# EAGLE design AmbaSat-1v1-01-NO-solar (EAGLE 7.6.0)
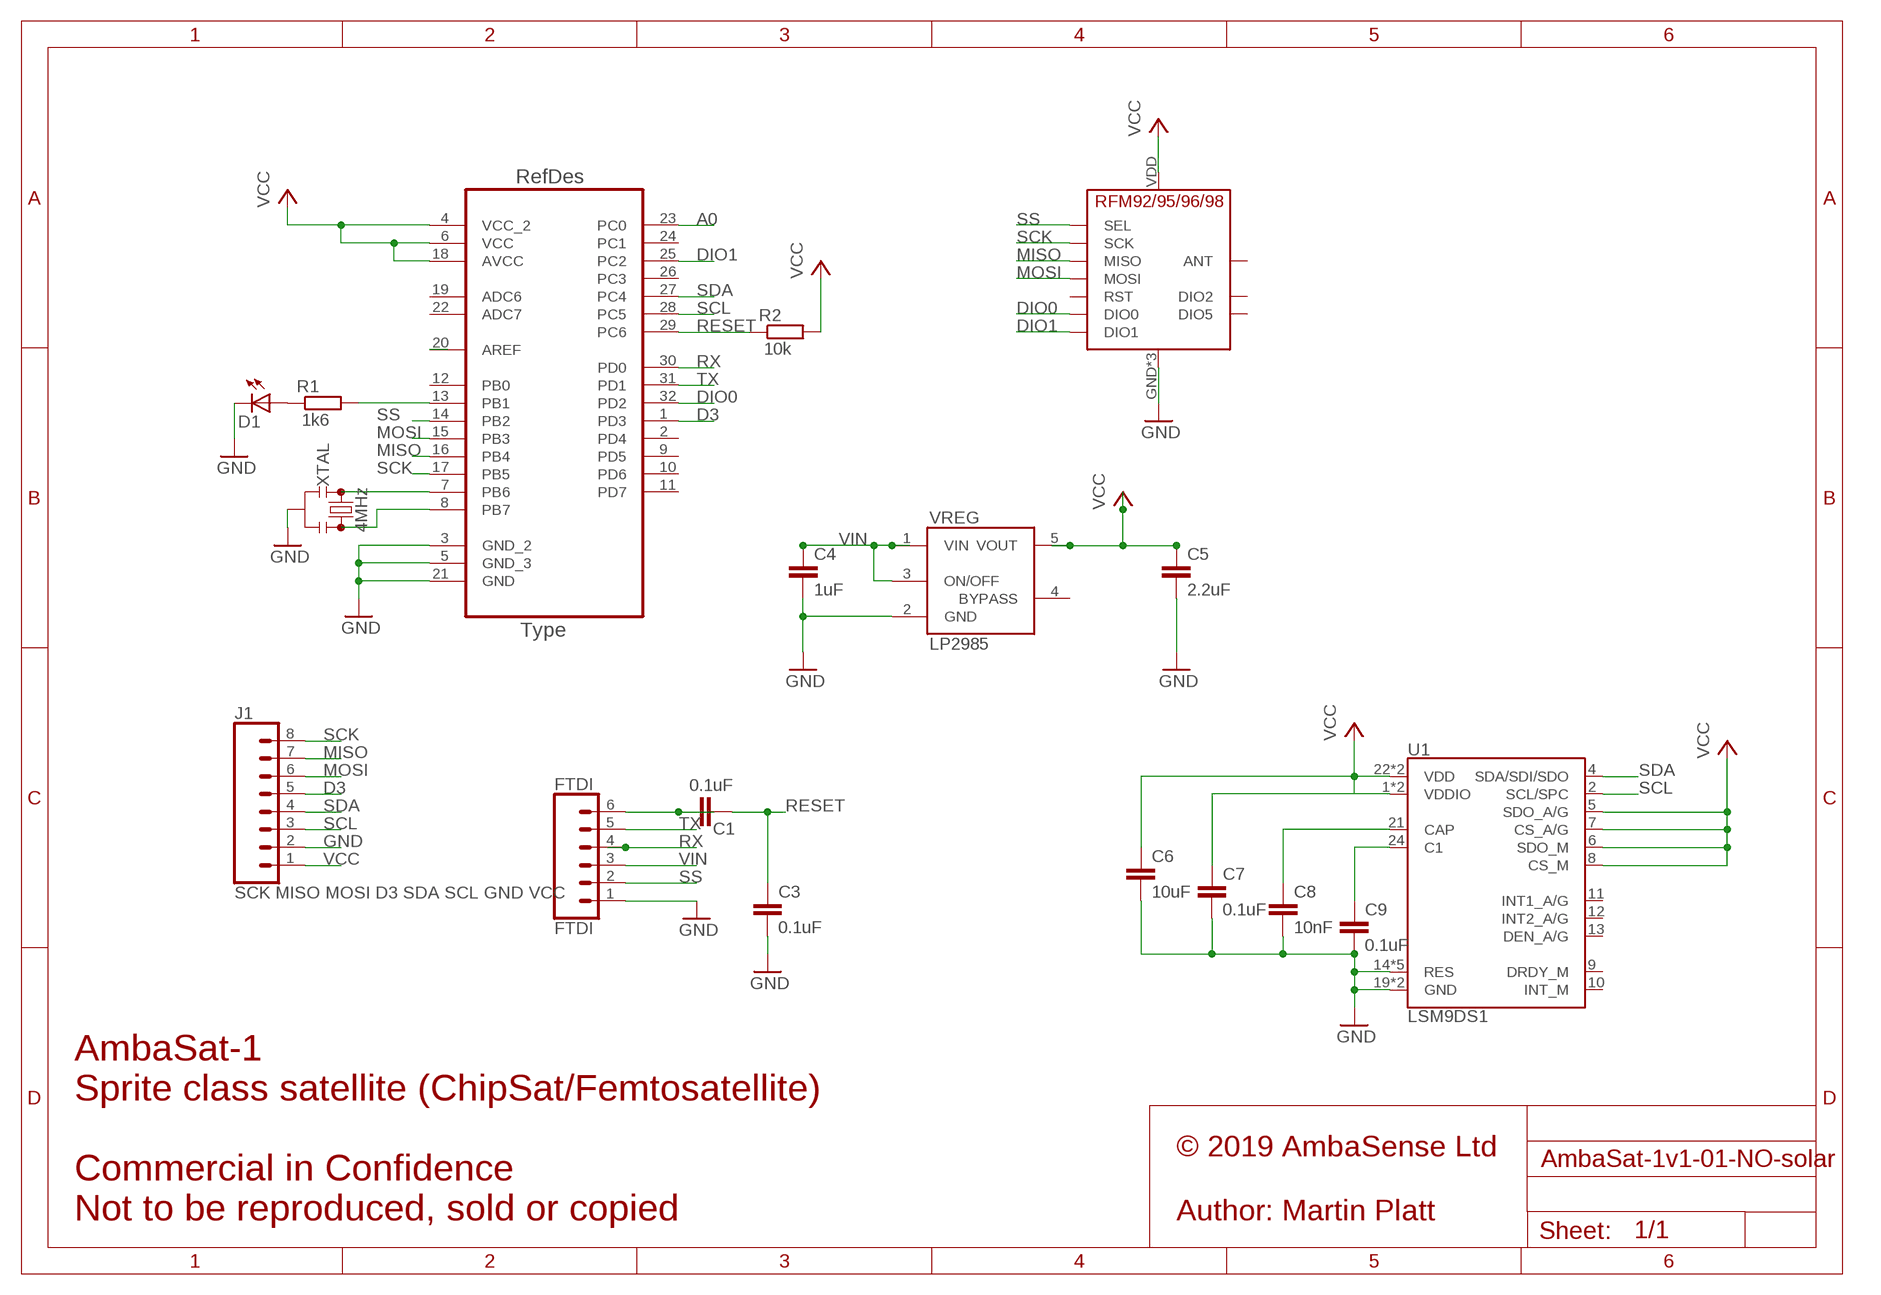
[diagram p0: schematic, sheet 1]

## Parts
ATMEGA328P-AU  ATMEGA328P-AU  [QFP80P900X900X120-32N]
C1  0.1uF  C-EUC0805K  [C0805K]
C3  0.1uF  C-EUC0805K  [C0805K]
C4  1uF  C-EUC0805K  [C0805K]
C5  2.2uF  C-EUC0805K  [C0805K]
C6  10uF  C-EUC0805K  [C0805K]
C7  0.1uF  C-EUC0805K  [C0805K]
C8  10nF  C-EUC0805K  [C0805K]
C9  0.1uF  C-EUC0805K  [C0805K]
D1  LEDCHIP-LED0805  [CHIP-LED0805]
FTDI  FTDI  CONN_06LONGPADS  [1X06_LONGPADS]
J1  SCK MISO MOSI D3 SDA SCL GND VCC  CONN_08LONGPADS  [1X08_LONGPADS]
R1  1k6  R-EU_M0805  [M0805]
R2  10k  R-EU_M0805  [M0805]
RFM95  RFM95  [RFM95]
U1  LSM9DS1  [LGA24-8X4]
VREG  LP2985AIM5-3.3  [SOT25]
XTAL  4MHz  RESONATOR-4MHZSMD-4.5X2  [RESONATOR-SMD-4.5X2.0]

## Nets
A0: ATMEGA328P-AU.23(PC0)
AREF: ATMEGA328P-AU.20(AREF)
D3: ATMEGA328P-AU.1(PD3) J1.5
DIO0: ATMEGA328P-AU.32(PD2) RFM95.DIO0
DIO1: ATMEGA328P-AU.25(PC2) RFM95.DIO1
GND: ATMEGA328P-AU.3(GND_2) ATMEGA328P-AU.5(GND_3) ATMEGA328P-AU.21(GND) C3.2 C4.2 C5.2 C6.2 C7.2 C8.2 C9.2 D1.C FTDI.1 J1.2 RFM95.GND RFM95.GND1(GND) RFM95.GND2(GND) U1.14(RES) U1.15(RES) U1.16(RES) U1.17(RES) U1.18(RES) U1.19(GND) U1.20(GND) VREG.2(GND) XTAL.2
MISO: ATMEGA328P-AU.16(PB4) J1.7 RFM95.MISO
MOSI: ATMEGA328P-AU.15(PB3) J1.6 RFM95.MOSI
N$1: ATMEGA328P-AU.7(PB6) XTAL.1
N$2: ATMEGA328P-AU.8(PB7) XTAL.3
N$3: ATMEGA328P-AU.13(PB1) R1.2
N$4: D1.A R1.1
N$6: C1.2 FTDI.6
N$7: C9.1 U1.24(C1)
N$8: C8.1 U1.21(CAP)
RESET: ATMEGA328P-AU.29(PC6) C1.1 C3.1 R2.1
RX: ATMEGA328P-AU.30(PD0) FTDI.4
SCK: ATMEGA328P-AU.17(PB5) J1.8 RFM95.SCK
SCL: ATMEGA328P-AU.28(PC5) J1.3 U1.2(SCL/SPC)
SDA: ATMEGA328P-AU.27(PC4) J1.4 U1.4(SDA/SDI/SDO)
SS: ATMEGA328P-AU.14(PB2) FTDI.2 RFM95.NSS(SEL)
TX: ATMEGA328P-AU.31(PD1) FTDI.5
VCC: ATMEGA328P-AU.4(VCC_2) ATMEGA328P-AU.6(VCC) ATMEGA328P-AU.18(AVCC) C5.1 C6.1 C7.1 J1.1 R2.2 RFM95.VDD(VCC) U1.1(VDDIO) U1.3(VDDIO) U1.5(SDO_A/G) U1.6(SDO_M) U1.7(CS_A/G) U1.8(CS_M) U1.22(VDD) U1.23(VDD) VREG.5(VOUT)
VIN: C4.1 FTDI.3 VREG.1(VIN) VREG.3(ON/OFF)
Unconnected: ATMEGA328P-AU.2(PD4) ATMEGA328P-AU.9(PD5) ATMEGA328P-AU.10(PD6) ATMEGA328P-AU.11(PD7) ATMEGA328P-AU.12(PB0) ATMEGA328P-AU.19(ADC6) ATMEGA328P-AU.22(ADC7) ATMEGA328P-AU.24(PC1) ATMEGA328P-AU.26(PC3) RFM95.ANT RFM95.DIO2 RFM95.DIO5 RFM95.RST U1.9(DRDY_M) U1.10(INT_M) U1.11(INT1_A/G) U1.12(INT2_A/G) U1.13(DEN_A/G) VREG.4(BYPASS)

## Notes on the sheet
- AmbaSat-1  
  Sprite class satellite (ChipSat/Femtosatellite)
  
  Commercial in Confidence
  Not to be reproduced, sold or copied
- © 2019 AmbaSense Ltd
  
  Author: Martin Platt

## Library data of the parts
ATMEGA328P-AU = Atmel-ATMEGA328P-AU:ATMEGA328P-AU; DESCRIPTION: 8-bit Microcontroller with In-System Programmable Flash; MPN: ATMEGA328P-AU; OC_FARNELL: 1715486; OC_NEWARK: 14R4631; PACKAGE: TQFP-32; SUPPLIER: Atmel
C1 C3-C9 = rcl:C-EU: CAPACITOR, European symbol
D1 = led:LED: LED OSRAM: - CHIPLED LG R971, LG N971, LY N971, LG Q971, LY Q971, LO R971, LY R971 LH N974, LH R974 LS Q976, LO Q976, LY Q976 LO Q996 - Hyper CHIPLED LW Q18S LB Q993, LB Q99A, LB R99A - SideLED LS A670, LO A670, LY A670, LG A670, LP A670 LB A673, LV A673, LT A673, LW A673 LH A674 LY A675 LS A676, LA A676, LO A676, LY A676, LW A676 LS A679, LY A679, LG A679 - Hyper Micro SIDELED® LS Y876, LA Y876, LO Y876, LY Y876 LT Y87S - SmartLED LW L88C, LW L88S LB L89C, LB L89S, LG L890 LS L89K, LO L89K, LY L89K LS L896, LA L896, LO L896, LY L896 - TOPLED LS T670, LO T670, LY T670, LG T670, LP T670 LSG T670, LSP T670, LSY T670, LOP T670, LYG T670 LG T671, LOG T671, LSG T671 LB T673, LV T673, LT T673, LW T673 LH T674 LS T676, LA T676, LO T676, LY T676, LB T676, LH T676, LSB T676, LW T676 LB T67C, LV T67C, LT T67C, LS T67K, LO T67K, LY T67K, LW E67C LS E67B, LA E67B, LO E67B, LY E67B, LB E67C, LV E67C, LT E67C LW T67C LS T679, LY T679, LG T679 LS T770, LO T770, LY T770, LG T770, LP T770 LB T773, LV T773, LT T773, LW T773 LH T774 LS E675, LA E675, LY E675, LS T675 LS T776, LA T776, LO T776, LY T776, LB T776 LHGB T686 LT T68C, LB T68C - Hyper Mini TOPLED® LB M676 - Mini TOPLED Santana® LG M470 LS M47K, LO M47K, LY M47K Source: http://www.osram.convergy.de LUXEON: - LUMILED® LXK2-PW12-R00, LXK2-PW12-S00, LXK2-PW14-U00, LXK2-PW14-V00 LXK2-PM12-R00, LXK2-PM12-S00, LXK2-PM14-U00 LXK2-PE12-Q00, LXK2-PE12-R00, LXK2-PE12-S00, LXK2-PE14-T00, LXK2-PE14-U00 LXK2-PB12-K00, LXK2-PB12-L00, LXK2-PB12-M00, LXK2-PB14-N00, LXK2-PB14-P00, LXK2-PB14-Q00 LXK2-PR12-L00, LXK2-PR12-M00, LXK2-PR14-Q00, LXK2-PR14-R00 LXK2-PD12-Q00, LXK2-PD12-R00, LXK2-PD12-S00 LXK2-PH12-R00, LXK2-PH12-S00 LXK2-PL12-P00, LXK2-PL12-Q00, LXK2-PL12-R00 Source: www.luxeon.com KINGBRIGHT: KA-3528ASYC Source: www.kingbright.com
FTDI = SparkFun-Connectors:CONN_06: Multi connection point. Often used as Generic Header-pin footprint for 0.1 inch spaced/style header connections On any of the 0.1 inch spaced packages, you can populate with these: Break Away Headers - Straight <https://www.sparkfun.com/products/116> (PRT-00116) Break Away Male Headers - Right Angle <https://www.sparkfun.com/products/553> (PRT-00553) Female Headers <https://www.sparkfun.com/products/115> (PRT-00115) Break Away Headers - Machine Pin <https://www.sparkfun.com/products/117> (PRT-00117) Break Away Female Headers - Swiss Machine Pin <https://www.sparkfun.com/products/743> (PRT-00743) Arduino Stackable Header - 6 Pin <https://www.sparkfun.com/products/9280> (PRT-09280) For SCREWTERMINALS and SPRING TERMINALS visit here: Screw Terimnals on SparkFun.com <https://www.sparkfun.com/search/results?term=Screw+Terminals> (5mm/3.5mm/2.54mm spacing) This device is also useful as a general connection point to wire up your design to another part of your project. Our various solder wires solder well into these plated through hole pads. Hook-Up Wire - Assortment (Stranded, 22 AWG) <https://www.sparkfun.com/products/11375> (PRT-11375) Hook-Up Wire - Assortment (Solid Core, 22 AWG) <https://www.sparkfun.com/products/11367> (PRT-11367) View the entire wire category on our website here <https://www.sparkfun.com/categories/141>
J1 = SparkFun-Connectors:CONN_08: Multi connection point. Often used as Generic Header-pin footprint for 0.1 inch spaced/style header connections On any of the 0.1 inch spaced packages, you can populate with these: Break Away Headers - Straight <https://www.sparkfun.com/products/116> (PRT-00116) Break Away Male Headers - Right Angle <https://www.sparkfun.com/products/553> (PRT-00553) Female Headers <https://www.sparkfun.com/products/115> (PRT-00115) Break Away Headers - Machine Pin <https://www.sparkfun.com/products/117> (PRT-00117) Break Away Female Headers - Swiss Machine Pin <https://www.sparkfun.com/products/743> (PRT-00743) Arduino Stackable Header - 8 Pin <https://www.sparkfun.com/products/9279> (PRT-09279) For SCREWTERMINALS and SPRING TERMINALS visit here: Screw Terimnals on SparkFun.com <https://www.sparkfun.com/search/results?term=Screw+Terminals> (5mm/3.5mm/2.54mm spacing) This device is also useful as a general connection point to wire up your design to another part of your project. Our various solder wires solder well into these plated through hole pads. Hook-Up Wire - Assortment (Stranded, 22 AWG) <https://www.sparkfun.com/products/11375> (PRT-11375) Hook-Up Wire - Assortment (Solid Core, 22 AWG) <https://www.sparkfun.com/products/11367> (PRT-11367) View the entire wire category on our website here <https://www.sparkfun.com/categories/141> Special notes: Molex polarized connector foot print use with SKU : PRT-08231 with associated crimp pins and housings. 1MM SMD Version SKU: PRT-10208 NOTES ON THE VARIANTS LOCK and LOCK_LONGPADS... This footprint was designed to help hold the alignment of a through-hole component (i.e. 6-pin header) while soldering it into place. You may notice that each hole has been shifted either up or down by 0.005 of an inch from it's more standard position (which is a perfectly straight line). This slight alteration caused the pins (the squares in the middle) to touch the edges of the holes. Because they are alternating, it causes a "brace" to hold the component in place. 0.005 has proven to be the perfect amount of "off-center" position when using our standard breakaway headers. Although looks a little odd when you look at the bare footprint, once you have a header in there, the alteration is very hard to notice. Also,if you push a header all the way into place, it is covered up entirely on the bottom side.
R1 R2 = rcl:R-EU_: RESISTOR, European symbol
RFM95 = _c2h:RFM95
U1 = LSM9DS1:LSM9DS1: LSM9DS1 3D accelerometer, gyroscope & magnetometer The LSM9DS1 is a system-in-package featuring a 3D digital linear acceleration sensor, a 3D digital angular rate sensor, and a 3D digital magnetic sensor. The LSM9DS1 has a linear acceleration full scale of ±2g/±4g/±8/±16 g, a magnetic field full scale of ±4/±8/±12/±16 gauss and an angular rate of ±245/±500/±2000 dps. The LSM9DS1 includes an I2 C serial bus interface supporting standard and fast mode (100 kHz and 400 kHz) and an SPI serial standard interface. Magnetic, accelerometer and gyroscope sensing can be enabled or set in power-down mode separately for smart power management. The LSM9DS1 is available in a plastic land grid array package (LGA) and it is guaranteed to operate over an extended temperature range from -40 °C to +85 °C.; PROD_ID: IC-12536
VREG = LP2985:LP2985: LP2985-N Micropower 150 mA Low-Noise Ultra Low-Dropout Regulator
XTAL = SparkFun-Clocks:RESONATOR-4MHZ: 4MHz Resonator Digikey Example <http://www.digikey.com/product-search/en?keywords=490-1200-1-ND> Frequency: 4MHz Frequency Stability: ±0.2% Frequency Tolerance: ±0.5% Capacitance: 15pF SparkFun Products SparkFun BadgerHack <https://www.sparkfun.com/products/13333>; PROD_ID: XTAL-12492

## Board
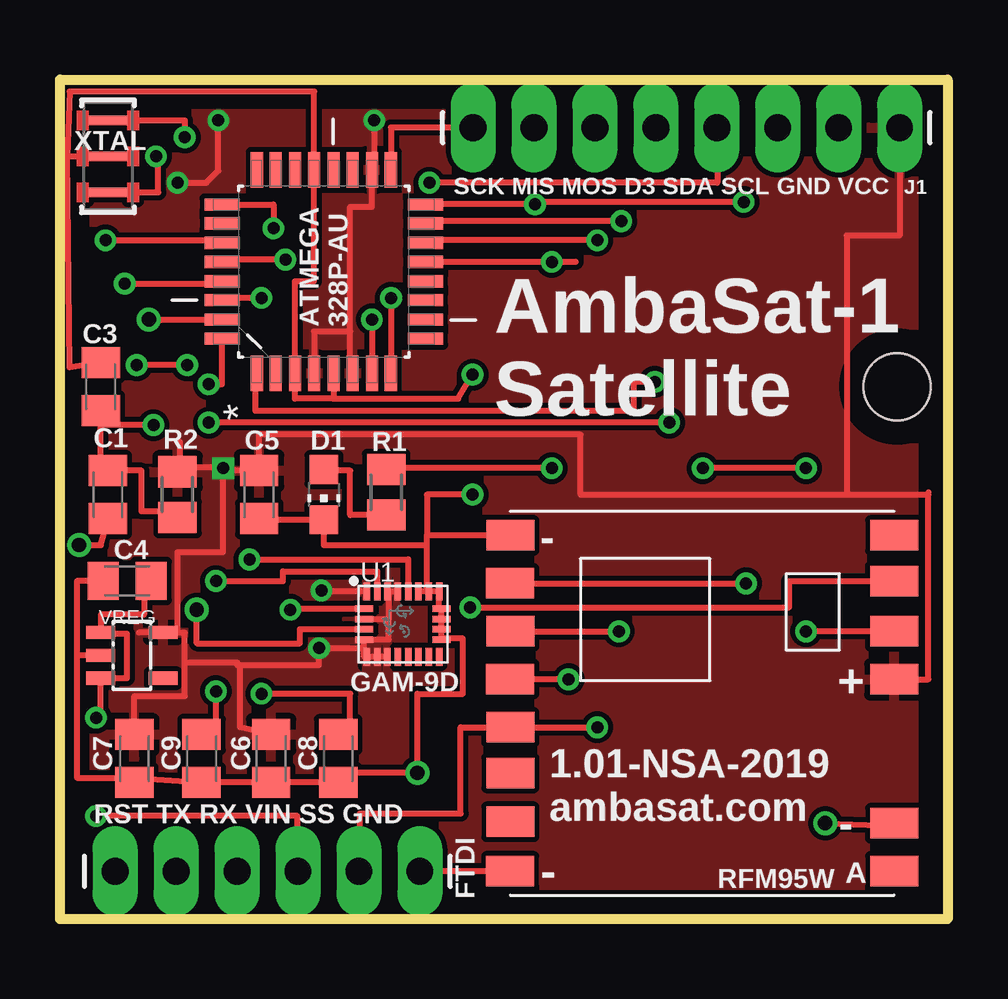
[diagram p1: board, top side]
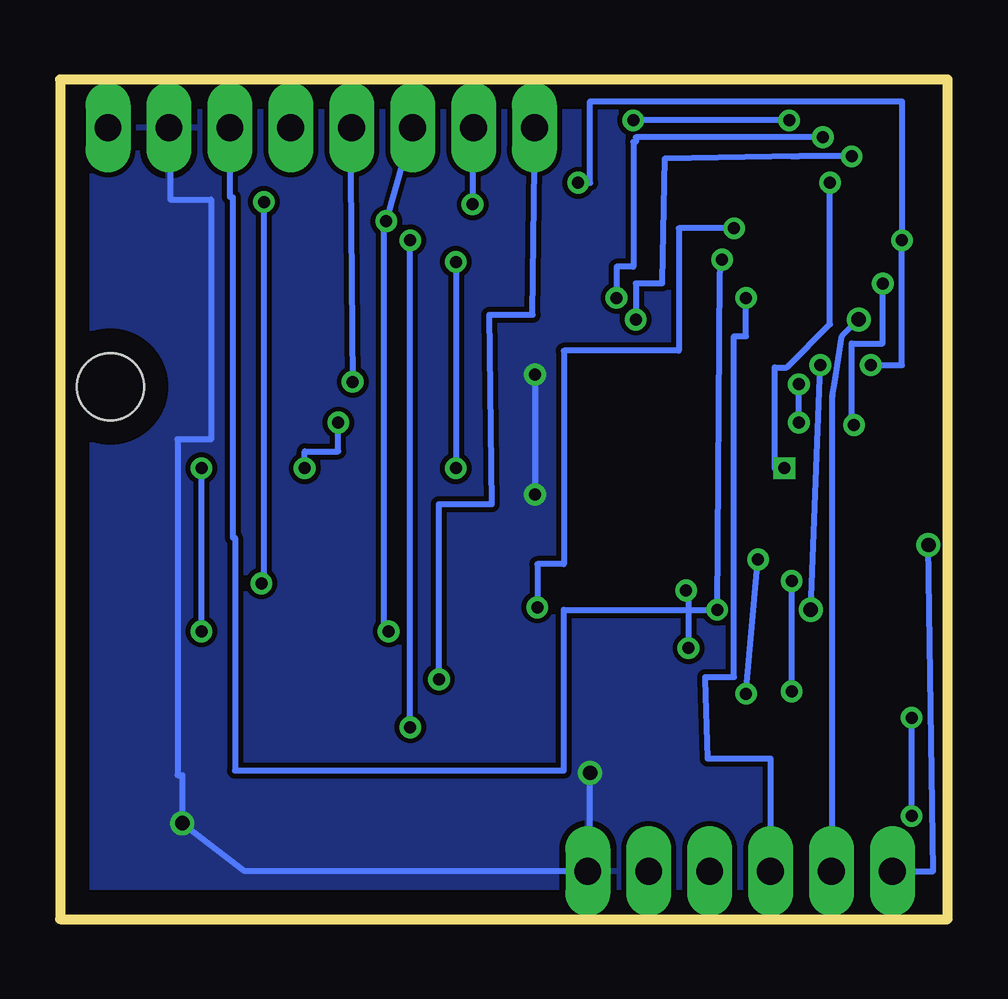
[diagram p2: board, bottom side, seen from below]

Size 37 x 35 mm. Coordinates in mm from the lower left corner, seen from the top.
Outline: 0,0 0,35 37,35 37,0 0,0
Copper layers (1*16): Top 0.035mm / dielectric 1.5mm / Bottom 0.035mm
Design rules "default": minimum track width 10mil, minimum drill 24mil, track to track 8mil, track to pad 8mil, pad to pad 8mil, via to via 8mil, smd to smd 8mil, copper to edge 40mil, drill to drill 8mil, minimum pad ring 10mil, minimum via ring 8mil, stop-mask expansion 4mil, vias tented up to drill 0mil, thermal gap 10mil
Holes 2.8 mm at 34.9,22.2

### Footprints (pad centres in the part's own frame; a part is rotated, then mirrored left to right if it is on the bottom)
QFP80P900X900X120-32N = smd 1.473 x 0.508: 1 -4.242,2.794; 2 -4.242,2.007; 3 -4.242,1.194; 4 -4.242,0.406; 5 -4.242,-0.406; 6 -4.242,-1.194; 7 -4.242,-2.007; 8 -4.242,-2.794; 17 4.242,-2.794; 18 4.242,-2.007; 19 4.242,-1.194; 20 4.242,-0.406; 21 4.242,0.406; 22 4.242,1.194; 23 4.242,2.007; 24 4.242,2.794 | smd 0.508 x 1.473: 9 -2.794,-4.242; 10 -2.007,-4.242; 11 -1.194,-4.242; 12 -0.406,-4.242; 13 0.406,-4.242; 14 1.194,-4.242; 15 2.007,-4.242; 16 2.794,-4.242; 25 2.794,4.242; 26 2.007,4.242; 27 1.194,4.242; 28 0.406,4.242; 29 -0.406,4.242; 30 -1.194,4.242; 31 -2.007,4.242; 32 -2.794,4.242
C0805K = smd 1.3 x 1.6: 1 -1,0; 2 1,0
CHIP-LED0805 = smd 1.2 x 1.2: A 0,-1.05; C 0,1.05
1X06_LONGPADS = drill 1.118 pad 1.88 long: 1 0,0; 2 2.54,0; 3 5.08,0; 4 7.62,0; 5 10.16,0; 6 12.7,0
1X08_LONGPADS = drill 1.118 pad 1.88 long: 1 0,0; 2 2.54,0; 3 5.08,0; 4 7.62,0; 5 10.16,0; 6 12.7,0; 7 15.24,0; 8 17.78,0
M0805 = smd 1.3 x 1.6: 1 -0.95,0; 2 0.95,0
RFM95 = smd 2 x 1.27: ANT 5.777,-7; DIO0 5.777,3; DIO1 5.779,5.095; DIO2 5.779,7; DIO5 -10.225,-4.936; GND 5.777,-5; GND1 -10.223,7; GND2 -10.23,-7; MISO -10.23,5; MOSI -10.225,3; NSS -10.223,-1; RST -10.223,-2.905; SCK -10.23,1.012; VDD 5.777,1
LGA24-8X4 = smd 0.27 x 0.75: 1 -1.505,1.365; 6 -1.505,-1.365; 7 -1.075,-1.365; 8 -0.645,-1.365; 9 -0.215,-1.365; 10 0.215,-1.365; 11 0.645,-1.365; 12 1.075,-1.365; 13 1.505,-1.365; 18 1.505,1.365; 19 1.075,1.365; 20 0.645,1.365; 21 0.215,1.365; 22 -0.215,1.365; 23 -0.645,1.365; 24 -1.075,1.365 | smd 0.75 x 0.27: 2 -1.615,0.645; 3 -1.615,0.215; 4 -1.615,-0.215; 5 -1.615,-0.645; 14 1.615,-0.645; 15 1.615,-0.215; 16 1.615,0.215; 17 1.615,0.645
SOT25 = smd 0.55 x 1.2: 1 -0.95,-1.3; 2 0,-1.3; 3 0.95,-1.3; 4 0.95,1.3; 5 -0.95,1.3
RESONATOR-SMD-4.5X2.0 = smd 0.4 x 1.6: 1 -1.5,0; 2 0,0; 3 1.5,0

### Placement (x,y rotation side)
ATMEGA328P-AU  11,27 90 top
C1  2,17.7 270 top
C3  1.7,22.2 90 top
C4  2.8,14.1 180 top
C5  8.3,17.7 270 top
C6  8.8,6.7 270 top
C7  3.1,6.7 270 top
C8  11.6,6.7 270 top
C9  5.9,6.7 270 top
D1  11,17.7 180 top
FTDI  15,2 180 top
J1  35,33 180 top
R1  13.6,17.8 90 top
R2  4.9,17.7 90 top
RFM95  29,9 0 top
U1  14.3,12.3 0 top
VREG  3,11 270 top
XTAL  2,31.8 90 top

### Tracks (layer width: path | path; a pad name or v marks a point on that pad's centre or on a via)
D3  (via drill 0.5)
  Top 0.254: J1.5 v24.9,33.1 | v24.8,22.4 23.9,22.4 23.9,21.2 8.14,21.2 8.14,22.76 ATMEGA328P-AU.1
  Bottom 0.254: v24.9,33.1 v24.8,22.4
DIO0  (via drill 0.5)
  Top 0.254: RFM95.DIO0 v31.1,12 | v31.1,18.8 v26.8,18.8 | v6.2,22.3 6.76,22.3 ATMEGA328P-AU.32 | v25.4,20.7 v6.2,20.7
  Bottom 0.254: v31.1,12 v31.1,18.8 | v26.8,18.8 26.8,19.5 25.4,19.5 v25.4,20.7 | v6.2,20.7 v6.2,22.3
DIO1  (via drill 0.5)
  Top 0.254: ATMEGA328P-AU.25 8.9,29.79 v8.9,28.8 | v17.1,13 30.4,13 30.4,14.1 RFM95.DIO1
  Bottom 0.254: v8.9,28.8 11.2,28.8 11.2,23.7 16,23.7 16,14.8 17.1,14.8 v17.1,13
GND  (via drill 0.5, 0.6)
  Top 0.254: VREG.2 0.7,11 | 0.7,11 0.7,5.9 3.1,5.9 | v14.9,6.1 12,6.1 C8.2 C6.2 C9.2 3.1,5.9 | v31.9,4 34.78,3.9 RFM95.GND | RFM95.GND2 FTDI.1 | RFM95.GND1 15.3,16 | 15.3,15.6 11,15.6 D1.C 8.3,16.65 C5.2 | 3.1,5.9 C7.2 | C4.2 0.7,14.1 0.7,11 | C3.2 0.4,23 0.3,31.8 | 0.3,31.8 XTAL.2 | 0.3,31.8 0.4,34.5 10.6,34.5 ATMEGA328P-AU.21 10.59,26.6 9.8,26.6 ATMEGA328P-AU.3 9.8,21.7 11.4,21.7 | 15,6.1 v14.9,6.1 | v14.9,6.1 14.9,9.4 16.8,9.4 16.8,11.7 15.91,11.7 U1.14 U1.15 U1.16 U1.17 15.8,12.95 U1.18 U1.19 | U1.19 U1.20 | 15.3,15.6 15.3,16 | U1.19 15.3,13.66 15.3,15.6 | ATMEGA328P-AU.5 11.41,21.71 11.4,21.7 | 11.4,21.7 16.6,21.7 v17.2,22.7 | v17.2,17.7 15.3,17.7 15.3,16
  Bottom 0.254: v14.9,6.1 14.9,2 FTDI.1 29.3,2 v31.9,4 31.9,6 32.1,6 32.1,20 30.7,20 30.7,30 32.4,30 32.4,33 32.6,33 | v17.2,22.7 v17.2,17.7
  pour Bottom: 0,35 37,35 37,0 0,0
MISO  (via drill 0.5)
  Top 0.254: J1.7 v19.8,33 | ATMEGA328P-AU.16 v19.8,29.8 19.8,29.9 v28.5,29.9 | RFM95.MISO v28.6,14
  Bottom 0.254: v19.8,33 v19.8,29.8 | v28.6,14 28.5,14 v28.5,29.9
MOSI  (via drill 0.5)
  Top 0.254: v23.4,29.1 15.24,29.1 ATMEGA328P-AU.15 | RFM95.MOSI v23.3,12 23.4,12
  Bottom 0.254: J1.6 v23.4,29.1 23.5,29.1 23.5,12 v23.3,12
N$1  (via drill 0.5)
  Top 0.254: XTAL.1 4.1,30.3 4.1,31.8 v4,31.8 | v13,25 v13.01,25 ATMEGA328P-AU.7
  Bottom 0.254: v4,31.8 6.2,31.8 | 6.5,31.8 6.2,31.8 | 6.2,31.8 11.8,31.7 11.9,26.6 11.9,26.5 13,26.5 v13,25
N$2  (via drill 0.5)
  Top 0.254: 13.9,22.86 ATMEGA328P-AU.8 v13.79,25.9 v13.8,25.9 | XTAL.3 5.2,33.3 v5.2,32.6
  Bottom 0.254: v5.2,32.6 13,32.6 13,32.4 13.1,32.4 13.1,27.2 13.8,27.2 v13.8,25.9
N$3  (via drill 0.5)
  Top 0.254: ATMEGA328P-AU.13 21.5,27.41 v20.5,27.4 | 14.2,18.5 R1.2 13.6,18.8 v20.5,18.8
  Bottom 0.254: v20.5,27.4 v20.5,18.8
N$4
  Top 0.254: R1.1 12.1,16.85 12.1,18.7 11,18.7 D1.A
N$6  (via drill 0.6)
  Top 0.254: v0.8,15.6 1.7,15.6 C1.2
  Bottom 0.254: FTDI.6 0.6,2 v0.8,15.6
N$7  (via drill 0.5)
  Top 0.254: C9.1 6.5,7.9 v6.5,9.5 | v6.5,14.1 9.3,14.1 9.3,14.5 13.22,14.5 U1.24
  Bottom 0.254: v6.5,9.5 v6.5,14.1
N$8  (via drill 0.5)
  Top 0.254: C8.1 12.1,8 12.1,9.4 v8.4,9.4 | v7.9,15 14.52,15 U1.21 14.5,13.66
  Bottom 0.254: v8.4,9.4 v7.9,15
RESET  (via drill 0.5)
  Top 0.254: R2.1 4.9,17 3.4,17 3.4,18.7 C1.1 1.7,18.7 C3.1 1.7,20.6 v3.9,20.6 | v2.7,26.5 6.76,26.5 ATMEGA328P-AU.29
  Bottom 0.254: v3.9,20.6 4,21 4,24 2.7,24 v2.7,26.5
RX  (via drill 0.5)
  Top 0.254: v8.4,25.9 6.85,25.9 ATMEGA328P-AU.30
  Bottom 0.254: v8.4,25.9 8.4,24.3 8.9,24.3 8.9,10.1 10.1,10.1 10.1,10 10,6.7 7.38,6.7 FTDI.4
SCK  (via drill 0.5)
  Top 0.254: J1.8 13.79,33 ATMEGA328P-AU.17 | RFM95.SCK 21.2,10.01 v21.2,10
  Bottom 0.254: v21.2,10 21.2,17.3 19,17.3 19.1,25.2 17.3,25.2 17.2,33 J1.8
SCL  (via drill 0.5)
  Top 0.254: v9.4,27.5 6.76,27.5 ATMEGA328P-AU.28 | v9.6,12.9 9.74,12.95 U1.2
  Bottom 0.254: J1.3 29.92,30.12 29.8,30.1 29.8,15.9 29.7,15.9 29.7,6.2 16,6.2 16,12.9 v9.6,12.9 9.5,26.9 v9.4,27.5
SDA  (via drill 0.5, 0.6)
  Top 0.254: v5.3,23.1 v3.2,23.1 | v1.9,28.3 6.76,28.3 ATMEGA328P-AU.27 | U1.4 10,12.1 10,11.5 5.7,11.5 v5.7,12.9 | v27.5,33 27.4,33 27.4,30.7 v15.4,30.7
  Bottom 0.254: v5.7,12.9 v5.3,23.1 | v3.2,23.1 1.9,23.1 v1.9,28.3 1.9,34.1 14.9,34.1 14.9,30.7 v15.4,30.7 | J1.4 v27.5,33
SS  (via drill 0.5)
  Top 0.254: FTDI.2 12.5,2 12.5,4.4 16.7,4.4 16.7,8 RFM95.NSS v22.4,8 | v22.4,28.3 15.24,28.3 ATMEGA328P-AU.14
  Bottom 0.254: v22.4,8 v22.4,28.3
TX  (via drill 0.6)
  Top 0.254: v3.7,25 ATMEGA328P-AU.31
  Bottom 0.254: FTDI.5 4.8,2 4.8,21.8 4.7,22.4 4.4,24.3 v3.7,25
VCC  (via drill 0.5)
  Top 0.254: 3.3,11.95 VREG.5 4.9,11.95 | C7.1 3.1,9.3 5.2,9.3 5.2,10.7 | 5.2,10.7 5.2,11.95 4.9,11.95 | 7.5,10.6 7.4,10.6 7.4,10.7 5.2,10.7 | R2.2 5,18.85 | 5,18.85 5,19.9 | 4.9,11.95 4.9,15.3 6.8,15.3 v6.8,18.8 | ATMEGA328P-AU.6 12.1,22.76 12.1,24.5 | 12.1,24.5 10.59,24.5 ATMEGA328P-AU.4 | RFM95.VDD 36.2,10 36.2,17.7 | 36.2,17.7 36.2,17.8 | U1.8 U1.7 U1.6 12.69,10.94 U1.5 | U1.5 13.7,11.65 13.7,12.5 | 13.7,12.5 12.69,12.5 U1.3 | 13.7,13.66 U1.22 | U1.23 13.7,13.66 | 13.7,13.66 13.7,12.5 | U1.1 11.3,13.66 v10.9,13.7 | U1.5 12.69,11.3 v10.8,11.3 10.8,10.6 7.5,10.6 | 12.1,24.5 12.1,29.7 13.01,29.7 ATMEGA328P-AU.18 13.1,31.34 v13.1,33.3 | v4.9,30.7 6.1,30.7 6.6,31.2 v6.6,33.3 | C6.1 7.5,8 7.5,10.6 | v6.8,18.8 6.8,18.7 C5.1 8.3,20.2 21.7,20.2 21.7,17.7 32.8,17.7 | 5,18.85 6.8,18.85 v6.8,18.8 | 32.8,17.7 36.2,17.7 | J1.1 35,28.5 32.8,28.5 32.8,17.7
  Bottom 0.254: v10.9,13.7 10.8,13.7 v10.8,11.3 | v6.8,18.8 7.2,18.8 7.2,23 6.7,23 4.9,24.8 v4.9,30.7 | v6.6,33.3 v13.1,33.3
  pour Top: 0,35 37,35 37,0 0,0
VIN  (via drill 0.5)
  Top 0.254: VREG.1 1.7,11.9 2.8,11.9 2.8,10.05 VREG.3 1.7,8.4 v1.5,8.4 | FTDI.3 9.92,2.48 9.9,2.48 9.9,4.3 v1.5,4.3 | VREG.1 1.8,11.95 | C4.1 3.5,14.1 3.5,12.7 1.7,12.7 VREG.1
  Bottom 0.254: v1.5,4.3 v1.5,8.4

### Text on the board
tPlace: SCK MIS MOS D3 SDA SCL GND VCC | ATMEGA / 328P-AU | AmbaSat-1 / Satellite | GAM-9D | RST TX RX VIN SS GND | 1.01-NSA-2019 / ambasat.com | RFM95W